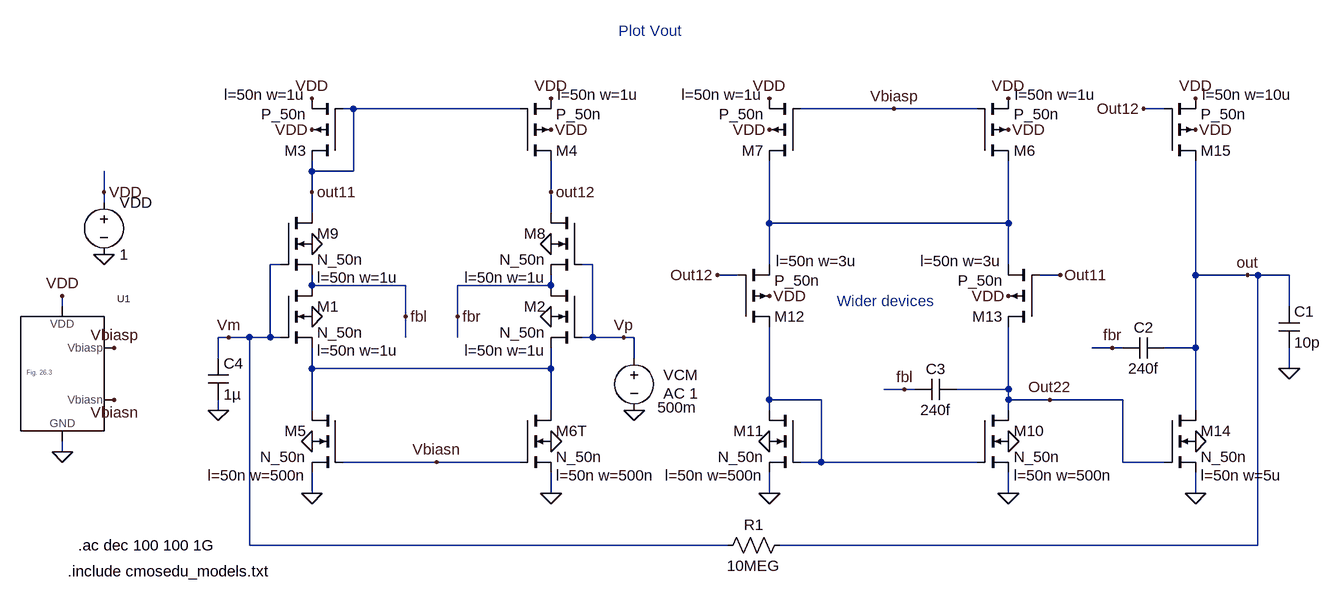
[diagram p0: schematic 3_stage_opamp_AC.asc]
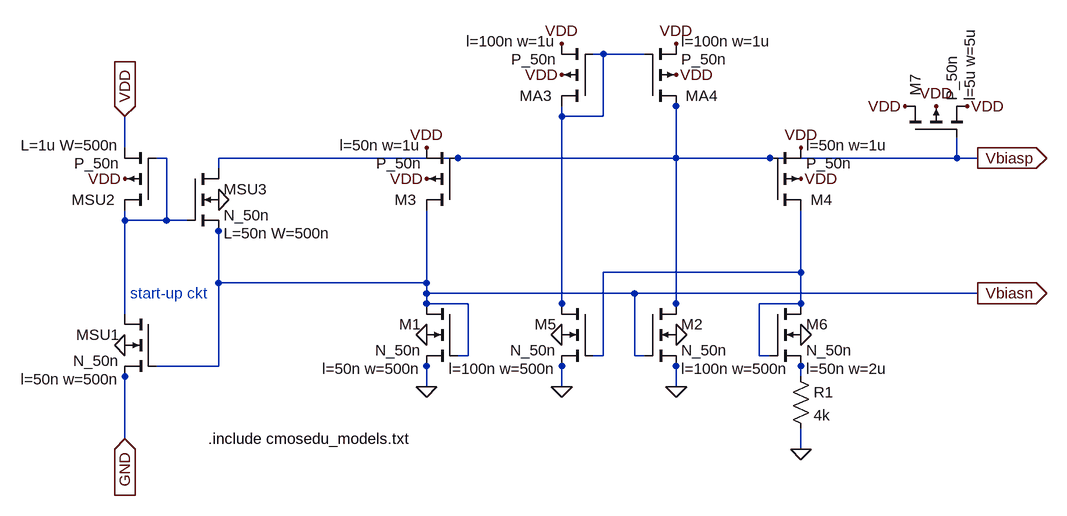
[diagram p1: sub-circuit fig_26_3.asc]
3_stage_opamp_AC.asc, the LTspice schematic file:
Version 4
SHEET 1 2760 680
WIRE 1248 -480 1232 -480
WIRE 1504 -480 1248 -480
WIRE 2080 -480 1936 -480
WIRE 2208 -480 2080 -480
WIRE 2496 -480 2464 -480
WIRE 1184 -384 1184 -400
WIRE 1248 -384 1248 -480
WIRE 1248 -384 1184 -384
WIRE 864 -352 864 -384
WIRE 1184 -352 1184 -384
WIRE 1552 -352 1552 -400
WIRE 864 -336 864 -352
WIRE 1184 -320 1184 -352
WIRE 1552 -320 1552 -352
WIRE 1888 -304 1888 -400
WIRE 2256 -304 2256 -400
WIRE 2256 -304 1888 -304
WIRE 1136 -240 1120 -240
WIRE 1616 -240 1600 -240
WIRE 1888 -240 1888 -304
WIRE 2256 -240 2256 -304
WIRE 1840 -224 1808 -224
WIRE 2336 -224 2304 -224
WIRE 2544 -224 2544 -400
WIRE 2624 -224 2544 -224
WIRE 2640 -224 2624 -224
WIRE 2688 -224 2640 -224
WIRE 1184 -208 1184 -224
WIRE 1328 -208 1184 -208
WIRE 1552 -208 1552 -224
WIRE 1552 -208 1408 -208
WIRE 800 -176 800 -192
WIRE 2688 -176 2688 -224
WIRE 1328 -160 1328 -208
WIRE 1408 -160 1408 -208
WIRE 1056 -128 1040 -128
WIRE 1088 -128 1056 -128
WIRE 1120 -128 1120 -240
WIRE 1120 -128 1088 -128
WIRE 1136 -128 1120 -128
WIRE 1328 -128 1328 -160
WIRE 1408 -128 1408 -160
WIRE 1616 -128 1616 -240
WIRE 1616 -128 1600 -128
WIRE 1664 -128 1616 -128
WIRE 1680 -128 1664 -128
WIRE 2416 -112 2384 -112
WIRE 2432 -112 2416 -112
WIRE 2544 -112 2544 -224
WIRE 2544 -112 2496 -112
WIRE 1040 -96 1040 -128
WIRE 1680 -96 1680 -128
WIRE 1184 -80 1184 -112
WIRE 1552 -80 1552 -112
WIRE 1552 -80 1184 -80
WIRE 2688 -80 2688 -112
WIRE 2096 -48 2064 -48
WIRE 2112 -48 2096 -48
WIRE 2256 -48 2256 -144
WIRE 2256 -48 2176 -48
WIRE 1888 -32 1888 -144
WIRE 1968 -32 1888 -32
WIRE 2256 -32 2256 -48
WIRE 2320 -32 2256 -32
WIRE 2432 -32 2320 -32
WIRE 1040 -16 1040 -32
WIRE 1184 -16 1184 -80
WIRE 1552 -16 1552 -80
WIRE 1888 -16 1888 -32
WIRE 2256 -16 2256 -32
WIRE 2544 -16 2544 -112
WIRE 800 48 800 32
WIRE 1376 64 1232 64
WIRE 1504 64 1376 64
WIRE 1968 64 1968 -32
WIRE 1968 64 1936 64
WIRE 2208 64 1968 64
WIRE 2432 64 2432 -32
WIRE 2496 64 2432 64
WIRE 1184 112 1184 80
WIRE 1552 112 1552 80
WIRE 1888 112 1888 80
WIRE 2256 112 2256 80
WIRE 2544 112 2544 80
WIRE 1088 192 1088 -128
WIRE 1824 192 1088 192
WIRE 2640 192 2640 -224
WIRE 2640 192 1904 192
FLAG 864 -256 0
FLAG 864 -352 VDD
FLAG 1552 -160 0
FLAG 1552 112 0
FLAG 1184 -160 0
FLAG 1552 -496 VDD
FLAG 1552 -448 VDD
FLAG 1184 -448 VDD
FLAG 800 -192 VDD
FLAG 800 48 0
FLAG 1040 -16 0
FLAG 1184 -496 VDD
FLAG 1552 32 0
FLAG 1680 -16 0
FLAG 880 -32 Vbiasn
FLAG 880 -112 Vbiasp
FLAG 1184 112 0
FLAG 1184 32 0
FLAG 1376 64 Vbiasn
FLAG 1184 -352 out11
FLAG 1552 -352 out12
FLAG 2256 -496 VDD
FLAG 2256 -448 VDD
FLAG 1888 -448 VDD
FLAG 1888 -496 VDD
FLAG 2080 -480 Vbiasp
FLAG 1552 -272 0
FLAG 1184 -272 0
FLAG 2256 112 0
FLAG 2256 32 0
FLAG 1888 112 0
FLAG 1888 32 0
FLAG 1888 -192 VDD
FLAG 2256 -192 VDD
FLAG 2320 -32 Out22
FLAG 2544 112 0
FLAG 2544 32 0
FLAG 2544 -496 VDD
FLAG 2544 -448 VDD
FLAG 2688 -80 0
FLAG 2624 -224 out
FLAG 1664 -128 Vp
FLAG 2464 -480 Out12
FLAG 1808 -224 Out12
FLAG 2336 -224 Out11
FLAG 1328 -160 fbl
FLAG 1408 -160 fbr
FLAG 2096 -48 fbl
FLAG 2416 -112 fbr
FLAG 1056 -128 Vm
SYMBOL voltage 864 -352 R0
WINDOW 123 0 0 Left 2
WINDOW 39 0 0 Left 2
SYMATTR InstName VDD
SYMATTR Value 1
SYMBOL nmos4 1600 -208 M0
WINDOW 123 56 100 Left 2
SYMATTR Value2 l=50n w=1u
SYMATTR InstName M2
SYMATTR Value N_50n
SYMBOL nmos4 1136 -208 R0
WINDOW 123 56 100 Left 2
SYMATTR Value2 l=50n w=1u
SYMATTR InstName M1
SYMATTR Value N_50n
SYMBOL pmos4 1504 -400 M180
WINDOW 123 58 102 Left 2
WINDOW 0 56 16 Left 2
SYMATTR Value2 l=50n w=1u
SYMATTR InstName M4
SYMATTR Value P_50n
SYMBOL pmos4 1232 -400 R180
WINDOW 123 58 102 Left 2
WINDOW 0 56 16 Left 2
SYMATTR Value2 l=50n w=1u
SYMATTR InstName M3
SYMATTR Value P_50n
SYMBOL nmos4 1504 -16 R0
WINDOW 123 56 100 Left 2
SYMATTR Value2 l=50n w=500n
SYMATTR InstName M6T
SYMATTR Value N_50n
SYMBOL voltage 1680 -112 R0
WINDOW 0 45 42 Left 2
WINDOW 3 36 92 Left 2
WINDOW 123 45 70 Left 2
WINDOW 39 0 0 Left 2
SYMATTR InstName VCM
SYMATTR Value 500m
SYMATTR Value2 AC 1
SYMBOL Fig_26_3 736 -64 R0
SYMATTR InstName U1
SYMBOL nmos4 1232 -16 M0
WINDOW 123 56 100 Left 2
SYMATTR Value2 l=50n w=500n
SYMATTR InstName M5
SYMATTR Value N_50n
SYMBOL pmos4 2208 -400 M180
WINDOW 123 58 102 Left 2
WINDOW 0 56 16 Left 2
SYMATTR Value2 l=50n w=1u
SYMATTR InstName M6
SYMATTR Value P_50n
SYMBOL pmos4 1936 -400 R180
WINDOW 123 58 102 Left 2
WINDOW 0 56 16 Left 2
SYMATTR Value2 l=50n w=1u
SYMATTR InstName M7
SYMATTR Value P_50n
SYMBOL nmos4 1600 -320 M0
WINDOW 123 56 100 Left 2
SYMATTR Value2 l=50n w=1u
SYMATTR InstName M8
SYMATTR Value N_50n
SYMBOL nmos4 1136 -320 R0
WINDOW 123 56 100 Left 2
SYMATTR Value2 l=50n w=1u
SYMATTR InstName M9
SYMATTR Value N_50n
SYMBOL nmos4 2208 -16 R0
WINDOW 123 56 100 Left 2
SYMATTR Value2 l=50n w=500n
SYMATTR InstName M10
SYMATTR Value N_50n
SYMBOL nmos4 1936 -16 M0
WINDOW 123 56 100 Left 2
SYMATTR Value2 l=50n w=500n
SYMATTR InstName M11
SYMATTR Value N_50n
SYMBOL pmos4 1840 -144 M180
WINDOW 123 58 102 Left 2
WINDOW 0 56 16 Left 2
SYMATTR Value2 l=50n w=3u
SYMATTR InstName M12
SYMATTR Value P_50n
SYMBOL pmos4 2304 -144 R180
WINDOW 123 58 102 Left 2
WINDOW 0 56 16 Left 2
SYMATTR Value2 l=50n w=3u
SYMATTR InstName M13
SYMATTR Value P_50n
SYMBOL nmos4 2496 -16 R0
WINDOW 123 56 100 Left 2
SYMATTR Value2 l=50n w=5u
SYMATTR InstName M14
SYMATTR Value N_50n
SYMBOL pmos4 2496 -400 M180
WINDOW 123 58 102 Left 2
WINDOW 0 56 16 Left 2
SYMATTR Value2 l=50n w=10u
SYMATTR InstName M15
SYMATTR Value P_50n
SYMBOL cap 2672 -176 R0
SYMATTR InstName C1
SYMATTR Value 10p
SYMBOL cap 2496 -128 R90
WINDOW 0 0 32 VBottom 2
WINDOW 3 32 32 VTop 2
SYMATTR InstName C2
SYMATTR Value 240f
SYMBOL cap 2176 -64 R90
WINDOW 0 0 32 VBottom 2
WINDOW 3 32 32 VTop 2
SYMATTR InstName C3
SYMATTR Value 240f
SYMBOL cap 1024 -96 R0
SYMATTR InstName C4
SYMATTR Value 1µ
SYMBOL res 1920 176 R90
WINDOW 0 0 56 VBottom 2
WINDOW 3 32 56 VTop 2
SYMATTR InstName R1
SYMATTR Value 10MEG
TEXT 808 232 Left 2 !.include cmosedu_models.txt
TEXT 1656 -600 Left 2 ;Plot Vout
TEXT 824 192 Left 2 !.ac dec 100 100 1G
TEXT 1992 -184 Left 2 ;Wider devices

fig_26_3.asc, the sub-circuit schematic file:
Version 4
SHEET 1 2004 680
WIRE 1280 -320 1264 -320
WIRE 1344 -320 1280 -320
WIRE 1392 -240 1392 -256
WIRE 1840 -240 1824 -240
WIRE 1216 -224 1216 -240
WIRE 1280 -224 1280 -320
WIRE 1280 -224 1216 -224
WIRE 544 -176 544 -224
WIRE 608 -160 592 -160
WIRE 1056 -160 688 -160
WIRE 1392 -160 1392 -240
WIRE 1392 -160 1056 -160
WIRE 1536 -160 1392 -160
WIRE 1824 -160 1824 -192
WIRE 1824 -160 1536 -160
WIRE 1856 -160 1824 -160
WIRE 688 -144 688 -160
WIRE 544 -64 544 -80
WIRE 608 -64 608 -160
WIRE 608 -64 544 -64
WIRE 640 -64 608 -64
WIRE 688 -48 688 -64
WIRE 1584 16 1584 -80
WIRE 1584 16 1280 16
WIRE 688 32 688 -48
WIRE 1008 32 1008 -80
WIRE 1008 32 688 32
WIRE 1008 48 1008 32
WIRE 1328 48 1008 48
WIRE 1856 48 1328 48
WIRE 1008 64 1008 48
WIRE 1072 64 1008 64
WIRE 1216 64 1216 -224
WIRE 1392 64 1392 -160
WIRE 1584 64 1584 16
WIRE 1584 64 1520 64
WIRE 544 80 544 -64
WIRE 1008 80 1008 64
WIRE 1216 80 1216 64
WIRE 1392 80 1392 64
WIRE 1072 144 1072 64
WIRE 1072 144 1056 144
WIRE 1280 144 1280 16
WIRE 1280 144 1264 144
WIRE 1328 144 1328 48
WIRE 1344 144 1328 144
WIRE 1520 144 1520 64
WIRE 1536 144 1520 144
WIRE 688 160 688 32
WIRE 688 160 592 160
WIRE 1008 160 1008 144
WIRE 1216 160 1216 144
WIRE 1392 160 1392 144
WIRE 1584 160 1584 144
WIRE 544 176 544 160
WIRE 1584 176 1584 160
WIRE 1008 192 1008 160
WIRE 1216 192 1216 160
WIRE 1392 192 1392 160
WIRE 544 272 544 176
WIRE 1584 288 1584 256
FLAG 544 -128 VDD
FLAG 1008 -128 VDD
FLAG 1008 -176 VDD
FLAG 1584 -128 VDD
FLAG 1584 -176 VDD
FLAG 1584 288 0
FLAG 1584 112 0
FLAG 1392 -288 VDD
FLAG 1392 -336 VDD
FLAG 1216 -288 VDD
FLAG 1216 -336 VDD
FLAG 1392 112 0
FLAG 1792 -240 VDD
FLAG 1744 -240 VDD
FLAG 1840 -240 VDD
FLAG 544 -224 VDD
IOPIN 544 -224 In
FLAG 544 272 GND
IOPIN 544 272 In
FLAG 688 -96 0
FLAG 544 128 0
FLAG 1008 192 0
FLAG 1008 112 0
FLAG 1216 112 0
FLAG 1216 192 0
FLAG 1392 192 0
FLAG 1856 -160 Vbiasp
IOPIN 1856 -160 Out
FLAG 1856 48 Vbiasn
IOPIN 1856 48 Out
SYMBOL pmos4 592 -80 R180
WINDOW 0 63 16 Left 2
WINDOW 123 56 100 Left 2
SYMATTR InstName MSU2
SYMATTR Value2 L=1u W=500n
SYMATTR Value P_50n
SYMBOL nmos4 592 80 M0
WINDOW 123 56 100 Left 2
SYMATTR Value2 l=50n w=500n
SYMATTR InstName MSU1
SYMATTR Value N_50n
SYMBOL nmos4 640 -144 R0
WINDOW 123 56 100 Left 2
SYMATTR Value2 L=50n W=500n
SYMATTR InstName MSU3
SYMATTR Value N_50n
SYMBOL pmos4 1056 -80 R180
WINDOW 0 63 16 Left 2
WINDOW 123 56 100 Left 2
SYMATTR InstName M3
SYMATTR Value2 l=50n w=1u
SYMATTR Value P_50n
SYMBOL pmos4 1536 -80 M180
WINDOW 0 63 16 Left 2
WINDOW 123 56 100 Left 2
SYMATTR InstName M4
SYMATTR Value2 l=50n w=1u
SYMATTR Value P_50n
SYMBOL nmos4 1056 64 M0
WINDOW 123 56 100 Left 2
SYMATTR Value2 l=50n w=500n
SYMATTR InstName M1
SYMATTR Value N_50n
SYMBOL res 1568 160 R0
SYMATTR InstName R1
SYMATTR Value 4k
SYMBOL pmos4 1344 -240 M180
WINDOW 0 63 16 Left 2
WINDOW 123 56 100 Left 2
SYMATTR InstName MA4
SYMATTR Value2 l=100n w=1u
SYMATTR Value P_50n
SYMBOL pmos4 1264 -240 R180
WINDOW 0 63 16 Left 2
WINDOW 123 56 100 Left 2
SYMATTR InstName MA3
SYMATTR Value2 l=100n w=1u
SYMATTR Value P_50n
SYMBOL nmos4 1264 64 M0
WINDOW 123 56 100 Left 2
SYMATTR Value2 l=100n w=500n
SYMATTR InstName M5
SYMATTR Value N_50n
SYMBOL pmos4 1744 -192 R270
WINDOW 0 63 16 Left 2
WINDOW 123 56 100 Left 2
SYMATTR InstName M7
SYMATTR Value2 l=5u w=5u
SYMATTR Value P_50n
SYMBOL nmos4 1344 64 R0
WINDOW 123 56 100 Left 2
SYMATTR Value2 l=100n w=500n
SYMATTR InstName M2
SYMATTR Value N_50n
SYMBOL nmos4 1536 64 R0
WINDOW 123 56 100 Left 2
SYMATTR Value2 l=50n w=2u
SYMATTR InstName M6
SYMATTR Value N_50n
TEXT 552 48 Left 2 ;start-up ckt
TEXT 672 272 Left 2 !.include cmosedu_models.txt

The netlist it stands for:
* 3_stage_opamp_AC.asc
VDD VDD 0 1
M2 fbr Vp N002 0 N_50n l=50n w=1u
M1 fbl Vm N002 0 N_50n l=50n w=1u
M4 out12 out11 VDD VDD P_50n l=50n w=1u
M3 out11 out11 VDD VDD P_50n l=50n w=1u
M6T N002 Vbiasn 0 0 N_50n l=50n w=500n
VCM Vp 0 500m AC 1
XU1 Vbiasn Vbiasp VDD 0 fig_26_3
M5 N002 Vbiasn 0 0 N_50n l=50n w=500n
M6 N001 Vbiasp VDD VDD P_50n l=50n w=1u
M7 N001 Vbiasp VDD VDD P_50n l=50n w=1u
M8 out12 Vp fbr 0 N_50n l=50n w=1u
M9 out11 Vm fbl 0 N_50n l=50n w=1u
M10 Out22 N003 0 0 N_50n l=50n w=500n
M11 N003 N003 0 0 N_50n l=50n w=500n
M12 N003 out12 N001 VDD P_50n l=50n w=3u
M13 Out22 out11 N001 VDD P_50n l=50n w=3u
M14 out Out22 0 0 N_50n l=50n w=5u
M15 out out12 VDD VDD P_50n l=50n w=10u
C1 out 0 10p
C2 out fbr 240f
C3 Out22 fbl 240f
C4 Vm 0 1µ
R1 out Vm 10MEG

* block symbol definitions
.subckt fig_26_3 Vbiasn Vbiasp VDD GND
MSU2 N002 N002 VDD VDD P_50n L=1u W=500n
MSU1 N002 Vbiasn GND 0 N_50n l=50n w=500n
MSU3 Vbiasp N002 Vbiasn 0 N_50n L=50n W=500n
M3 Vbiasn Vbiasp VDD VDD P_50n l=50n w=1u
M4 N003 Vbiasp VDD VDD P_50n l=50n w=1u
M1 Vbiasn Vbiasn 0 0 N_50n l=50n w=500n
R1 N004 0 4k
MA4 Vbiasp N001 VDD VDD P_50n l=100n w=1u
MA3 N001 N001 VDD VDD P_50n l=100n w=1u
M5 N001 N003 0 0 N_50n l=100n w=500n
M7 VDD Vbiasp VDD VDD P_50n l=5u w=5u
M2 Vbiasp Vbiasn 0 0 N_50n l=100n w=500n
M6 N003 N003 N004 0 N_50n l=50n w=2u
* start-up ckt
.include cmosedu_models.txt
.ends fig_26_3

.model NMOS NMOS
.model PMOS PMOS
.lib standard.mos
.include cmosedu_models.txt
* Plot Vout
.ac dec 100 100 1G
* Wider devices
.backanno
.end